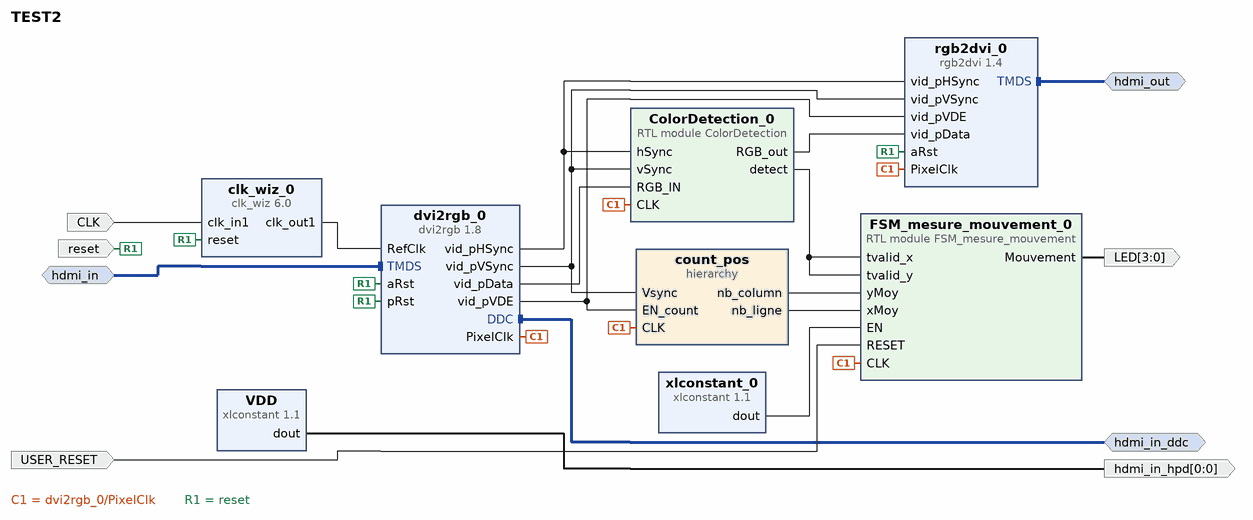
[diagram p0: block diagram of the top level]
# Vivado block design TEST2, xc7z020clg400-1, Vivado 2018.2.1
create_bd_design TEST2

create_bd_intf_port -mode Slave -vlnv digilentinc.com:interface:tmds_rtl:1.0 hdmi_in
create_bd_intf_port -mode Master -vlnv xilinx.com:interface:iic_rtl:1.0 hdmi_in_ddc
create_bd_intf_port -mode Master -vlnv digilentinc.com:interface:tmds_rtl:1.0 hdmi_out
create_bd_port -dir I -type clk CLK
set_property -dict {CONFIG.FREQ_HZ 125000000} [get_bd_ports CLK]
create_bd_port -dir O -from 0 -to 0 hdmi_in_hpd
create_bd_port -dir I -type rst reset
set_property -dict {CONFIG.POLARITY ACTIVE_HIGH} [get_bd_ports reset]
create_bd_port -dir I USER_RESET
create_bd_port -dir O -from 3 -to 0 LED

create_bd_cell -type hier count_pos
create_bd_cell -type ip -vlnv xilinx.com:ip:xlconstant:1.1 VDD
create_bd_cell -type ip -vlnv xilinx.com:ip:clk_wiz:6.0 clk_wiz_0
set_property -dict [list \
  CONFIG.PRIMITIVE PLL \
  CONFIG.CLKOUT1_REQUESTED_OUT_FREQ 200.000 \
  CONFIG.CLKOUT1_DRIVES BUFG \
  CONFIG.CLKOUT2_DRIVES BUFG \
  CONFIG.CLKOUT3_DRIVES BUFG \
  CONFIG.CLKOUT4_DRIVES BUFG \
  CONFIG.CLKOUT5_DRIVES BUFG \
  CONFIG.CLKOUT6_DRIVES BUFG \
  CONFIG.CLKOUT7_DRIVES BUFG \
  CONFIG.MMCM_DIVCLK_DIVIDE 1 \
  CONFIG.MMCM_CLKFBOUT_MULT_F 8 \
  CONFIG.MMCM_COMPENSATION ZHOLD \
  CONFIG.MMCM_CLKOUT0_DIVIDE_F 5 \
  CONFIG.CLKOUT1_JITTER 109.241 \
  CONFIG.CLKOUT1_PHASE_ERROR 96.948 \
] [get_bd_cells clk_wiz_0]
create_bd_cell -type ip -vlnv digilentinc.com:ip:dvi2rgb:1.8 dvi2rgb_0
set_property -dict [list \
  CONFIG.kEmulateDDC true \
  CONFIG.kEnableSerialClkOutput false \
  CONFIG.kClkRange 3 \
  CONFIG.kEdidFileName dgl_720p_cea.data \
] [get_bd_cells dvi2rgb_0]
create_bd_cell -type ip -vlnv digilentinc.com:ip:rgb2dvi:1.4 rgb2dvi_0
set_property -dict {CONFIG.kClkPrimitive MMCM CONFIG.kGenerateSerialClk true CONFIG.kClkRange 3} [get_bd_cells rgb2dvi_0]
create_bd_cell -type ip -vlnv xilinx.com:ip:xlconstant:1.1 xlconstant_0
create_bd_cell -type module -reference ColorDetection ColorDetection_0
create_bd_cell -type module -reference FSM_mesure_mouvement FSM_mesure_mouvement_0

# ---- hierarchy /count_pos ----
current_bd_instance /count_pos
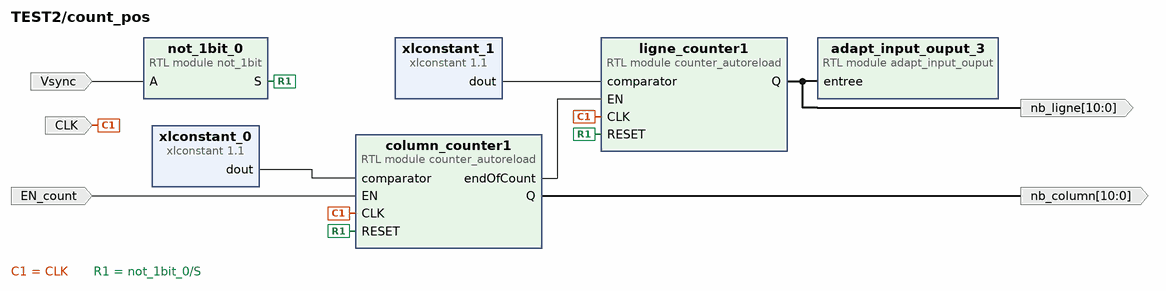
[diagram p1: block diagram inside /count_pos]
create_bd_pin -dir I -type clk CLK
create_bd_pin -dir I EN_count
create_bd_pin -dir O -from 10 -to 0 nb_ligne
create_bd_pin -dir O -from 10 -to 0 nb_column
create_bd_pin -dir I Vsync

create_bd_cell -type module -reference adapt_input_ouput adapt_input_ouput_3
set_property -dict {CONFIG.N 11 CONFIG.M 18} [get_bd_cells adapt_input_ouput_3]
create_bd_cell -type ip -vlnv xilinx.com:ip:xlconstant:1.1 xlconstant_0
set_property -dict {CONFIG.CONST_WIDTH 11 CONFIG.CONST_VAL 1599} [get_bd_cells xlconstant_0]
create_bd_cell -type ip -vlnv xilinx.com:ip:xlconstant:1.1 xlconstant_1
set_property -dict {CONFIG.CONST_WIDTH 11 CONFIG.CONST_VAL 899} [get_bd_cells xlconstant_1]
create_bd_cell -type module -reference counter_autoreload column_counter1
set_property -dict {CONFIG.N 11} [get_bd_cells column_counter1]
create_bd_cell -type module -reference counter_autoreload ligne_counter1
set_property -dict {CONFIG.N 11} [get_bd_cells ligne_counter1]
create_bd_cell -type module -reference not_1bit not_1bit_0

# ---- connections ----

current_bd_instance /count_pos
connect_bd_net [get_bd_pins CLK] [get_bd_pins column_counter1/CLK] [get_bd_pins ligne_counter1/CLK]
connect_bd_net -net column_counter_Q [get_bd_pins column_counter1/Q] [get_bd_pins nb_column]
connect_bd_net -net ligne_counter_Q [get_bd_pins ligne_counter1/Q] [get_bd_pins nb_ligne] [get_bd_pins adapt_input_ouput_3/entree]
connect_bd_net [get_bd_pins xlconstant_0/dout] [get_bd_pins column_counter1/comparator]
connect_bd_net [get_bd_pins xlconstant_1/dout] [get_bd_pins ligne_counter1/comparator]
connect_bd_net [get_bd_pins EN_count] [get_bd_pins column_counter1/EN]
connect_bd_net [get_bd_pins column_counter1/endOfCount] [get_bd_pins ligne_counter1/EN]
connect_bd_net [get_bd_pins Vsync] [get_bd_pins not_1bit_0/A]
connect_bd_net [get_bd_pins not_1bit_0/S] [get_bd_pins column_counter1/RESET] [get_bd_pins ligne_counter1/RESET]

current_bd_instance /
connect_bd_intf_net [get_bd_intf_ports hdmi_in] [get_bd_intf_pins dvi2rgb_0/TMDS]
connect_bd_intf_net [get_bd_intf_ports hdmi_in_ddc] [get_bd_intf_pins dvi2rgb_0/DDC]
connect_bd_intf_net [get_bd_intf_ports hdmi_out] [get_bd_intf_pins rgb2dvi_0/TMDS]
connect_bd_net [get_bd_ports CLK] [get_bd_pins clk_wiz_0/clk_in1]
connect_bd_net -net CLK_2 [get_bd_pins dvi2rgb_0/PixelClk] \
  [get_bd_pins rgb2dvi_0/PixelClk] [get_bd_pins count_pos/CLK] [get_bd_pins ColorDetection_0/CLK] \
  [get_bd_pins FSM_mesure_mouvement_0/CLK]
connect_bd_net -net Detect_centre_nb_column [get_bd_pins count_pos/nb_column] [get_bd_pins FSM_mesure_mouvement_0/yMoy]
connect_bd_net -net Detect_centre_nb_ligne [get_bd_pins count_pos/nb_ligne] [get_bd_pins FSM_mesure_mouvement_0/xMoy]
connect_bd_net [get_bd_pins VDD/dout] [get_bd_ports hdmi_in_hpd]
connect_bd_net [get_bd_pins clk_wiz_0/clk_out1] [get_bd_pins dvi2rgb_0/RefClk]
connect_bd_net [get_bd_pins dvi2rgb_0/vid_pHSync] [get_bd_pins rgb2dvi_0/vid_pHSync] [get_bd_pins ColorDetection_0/hSync]
connect_bd_net [get_bd_pins dvi2rgb_0/vid_pVSync] \
  [get_bd_pins rgb2dvi_0/vid_pVSync] [get_bd_pins count_pos/Vsync] [get_bd_pins ColorDetection_0/vSync]
connect_bd_net [get_bd_ports reset] \
  [get_bd_pins clk_wiz_0/reset] [get_bd_pins dvi2rgb_0/aRst] [get_bd_pins dvi2rgb_0/pRst] [get_bd_pins rgb2dvi_0/aRst]
connect_bd_net [get_bd_pins dvi2rgb_0/vid_pData] [get_bd_pins ColorDetection_0/RGB_IN]
connect_bd_net [get_bd_pins ColorDetection_0/RGB_out] [get_bd_pins rgb2dvi_0/vid_pData]
connect_bd_net [get_bd_ports USER_RESET] [get_bd_pins FSM_mesure_mouvement_0/RESET]
connect_bd_net [get_bd_pins ColorDetection_0/detect] [get_bd_pins FSM_mesure_mouvement_0/tvalid_x] [get_bd_pins FSM_mesure_mouvement_0/tvalid_y]
connect_bd_net [get_bd_pins xlconstant_0/dout] [get_bd_pins FSM_mesure_mouvement_0/EN]
connect_bd_net [get_bd_pins FSM_mesure_mouvement_0/Mouvement] [get_bd_ports LED]
connect_bd_net -net EN_count_1 [get_bd_pins dvi2rgb_0/vid_pVDE] [get_bd_pins count_pos/EN_count] [get_bd_pins rgb2dvi_0/vid_pVDE]

validate_bd_design
save_bd_design
